# EAGLE schematic MS20-RingMod (EAGLE 8.3.2)
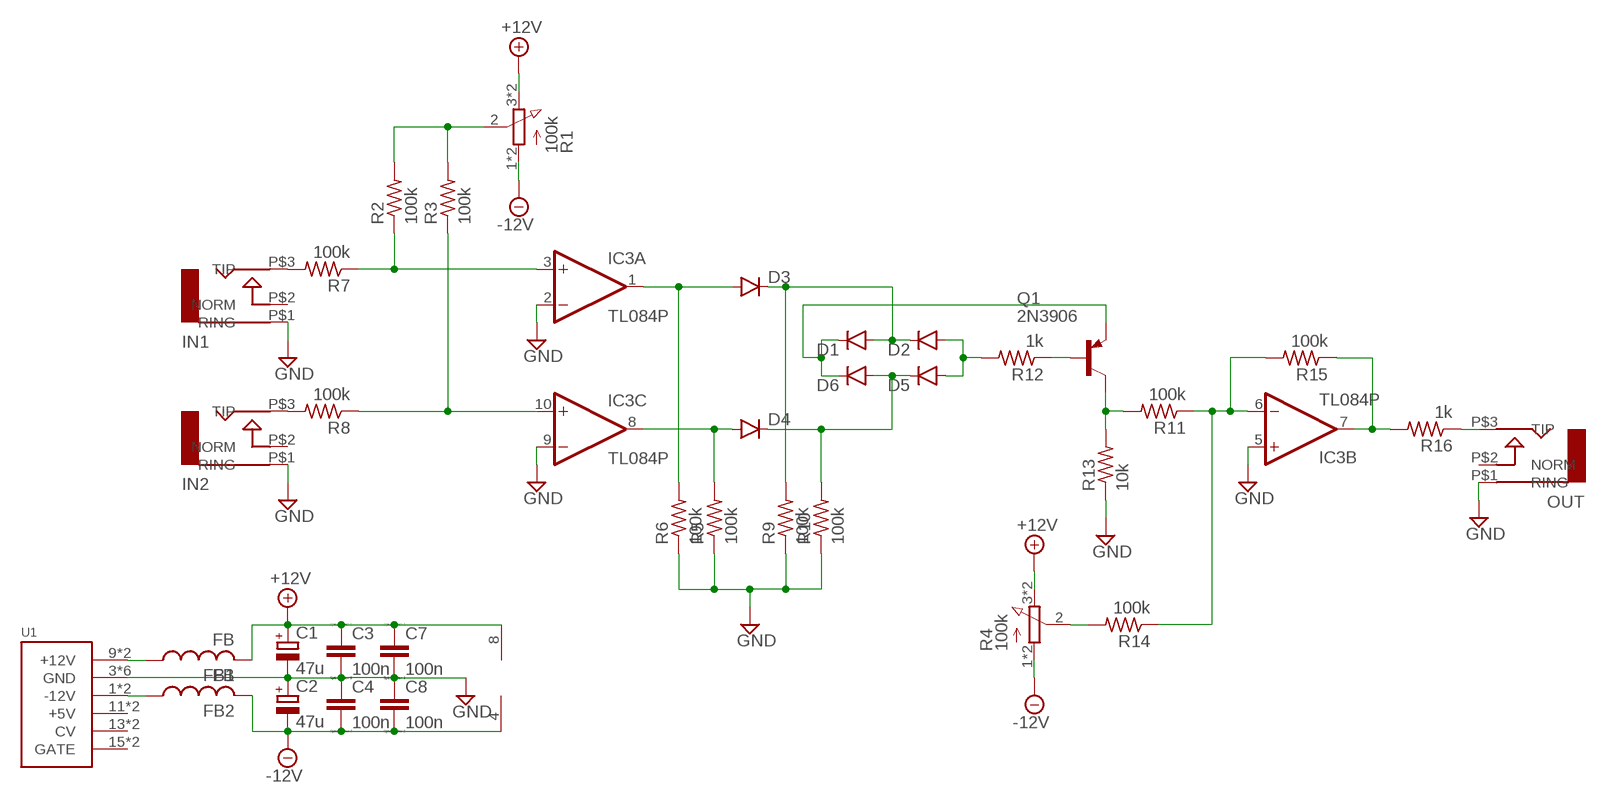
[diagram p0: schematic, sheet 1]

## Parts
C1  47u  CPOL-EUE2.5-7  [E2,5-7]
C2  47u  CPOL-EUE2.5-7  [E2,5-7]
C3  100n  C-EU025-025X050  [C025-025X050]
C4  100n  C-EU025-025X050  [C025-025X050]
C7  100n  C-EUC1206K  [C1206K]
C8  100n  C-EUC1206K  [C1206K]
D1  DIODE1N4148  [DIODE-1N4148]
D2  DIODE1N4148  [DIODE-1N4148]
D3  DIODE1N4148  [DIODE-1N4148]
D4  DIODE1N4148  [DIODE-1N4148]
D5  DIODE1N4148  [DIODE-1N4148]
D6  DIODE1N4148  [DIODE-1N4148]
FB1  FB  [FB]
FB2  FB  [FB]
IC1  TL072P  [DIL08]
IC3  TL084P  [DIL14]
IN1  AUDIO-JACKITEAD  [JACK-90DEG-ITEAD]
IN2  AUDIO-JACKITEAD  [JACK-90DEG-ITEAD]
OUT  AUDIO-JACKITEAD  [JACK-90DEG-ITEAD]
Q1  2N3906  [TO92]
R1  100k  3RP/1610N  [3RP/1610N]
R2  100k  R-US_0207/7  [0207/7]
R3  100k  R-US_0207/7  [0207/7]
R4  100k  3RP/1610N  [3RP/1610N]
R5  100k  R-US_0207/7  [0207/7]
R6  100k  R-US_0207/7  [0207/7]
R7  100k  R-US_0207/7  [0207/7]
R8  100k  R-US_0207/7  [0207/7]
R9  100k  R-US_0207/7  [0207/7]
R10  100k  R-US_0207/7  [0207/7]
R11  100k  R-US_0207/7  [0207/7]
R12  1k  R-US_0207/7  [0207/7]
R13  10k  R-US_0207/7  [0207/7]
R14  100k  R-US_0207/7  [0207/7]
R15  100k  R-US_0207/7  [0207/7]
R16  1k  R-US_0207/7  [0207/7]
U1  POWER  [POWER_16]

## Nets
+12V: C1.+ C3.1 C7.1 FB1.P$2 IC1.8(P:V+) R1.3(E) R1.6(E) R4.3(E) R4.6(E)
-12V: C2.- C4.2 C8.2 FB2.P$2 IC1.4(P:V-) R1.1(A) R1.4(A) R4.1(A) R4.4(A)
GND: C1.- C2.+ C3.2 C4.1 C7.2 C8.1 IC3.2(A:-IN) IC3.5(B:+IN) IC3.9(C:-IN) IN1.P$1(RING) IN2.P$1(RING) OUT.P$1(RING) R5.1 R6.1 R9.1 R10.1 R13.1 U1.3(GND) U1.4(GND) U1.5(GND) U1.6(GND) U1.7(GND) U1.8(GND)
N$1: IN1.P$3(TIP) R7.2
N$2: IN2.P$3(TIP) R8.2
N$3: Q1.1(C) R11.2 R13.2
N$5: D4.A IC3.8(C:OUT) R5.2
N$6: IC3.10(C:+IN) R3.1 R8.1
N$7: IC3.3(A:+IN) R2.1 R7.1
N$8: D3.A IC3.1(A:OUT) R6.2
N$9: D1.A D2.C D3.C R9.2
N$10: D4.C D5.C D6.A R10.2
N$11: R1.2(S) R2.2 R3.2
N$12: D1.C D6.C Q1.3(E)
N$13: D2.A D5.A R12.2
N$14: Q1.2(B) R12.1
N$15: R4.2(S) R14.2
N$16: IC3.7(B:OUT) R15.1 R16.2
N$17: OUT.P$3(TIP) R16.1
N$18: IC3.6(B:-IN) R11.1 R14.1 R15.2
N$61: FB1.P$1 U1.9(+12V) U1.10(+12V)
N$62: FB2.P$1 U1.1(-12V) U1.2(-12V)
Unconnected: IC1.1(A:OUT) IC1.2(A:-IN) IC1.3(A:+IN) IC1.5(B:+IN) IC1.6(B:-IN) IC1.7(B:OUT) IC3.12(D:+IN) IC3.13(D:-IN) IC3.14(D:OUT) IN1.P$2(NORM) IN2.P$2(NORM) OUT.P$2(NORM) U1.11(+5V) U1.12(+5V) U1.13(CV) U1.14(CV) U1.15(GATE) U1.16(GATE)

## Power pins joined to a net without a drawn wire
V+: IC3.4(P:V+)
V-: IC3.11(P:V-)

## Library data of the parts
C1 C2 = resistor:CPOL-EU: POLARIZED CAPACITOR, European symbol
C3 C4 C7 C8 = resistor:C-EU: CAPACITOR, European symbol; SPICEPREFIX: C
D1-D6 = SparkFun-DiscreteSemi:DIODE: Diode These are standard reverse protection diodes and small signal diodes. SMA package can handle up to about 1A. SOD-323 can handle about 200mA. What the SOD-323 package when ordering, there are some mfgs out there that are 5-pin packages.
FB1 FB2 = adafruit:FB: Ferrite bead Digikey #P9821BK-ND
IC1 = gm-ics:TL072: OP AMP
IC3 = linear:TL084: OP AMP
IN1 IN2 OUT = erthenvar:AUDIO-JACK: Switching Mono 3.5mm Audio Jack from Erthenvar.
Q1 = transistor-pnp:2N3906: PNP Transistor
R1 R4 = pot:3RP/1610N: 16mm Potentiometer one level Source: http://www.alphapotentiometers.net/html/16mm_pot_2.html
R2 R3 R5-R16 = rcl:R-US_: RESISTOR, American symbol
U1 = eurorack:POWER